# EAGLE design mcuPower (EAGLE 6.4)
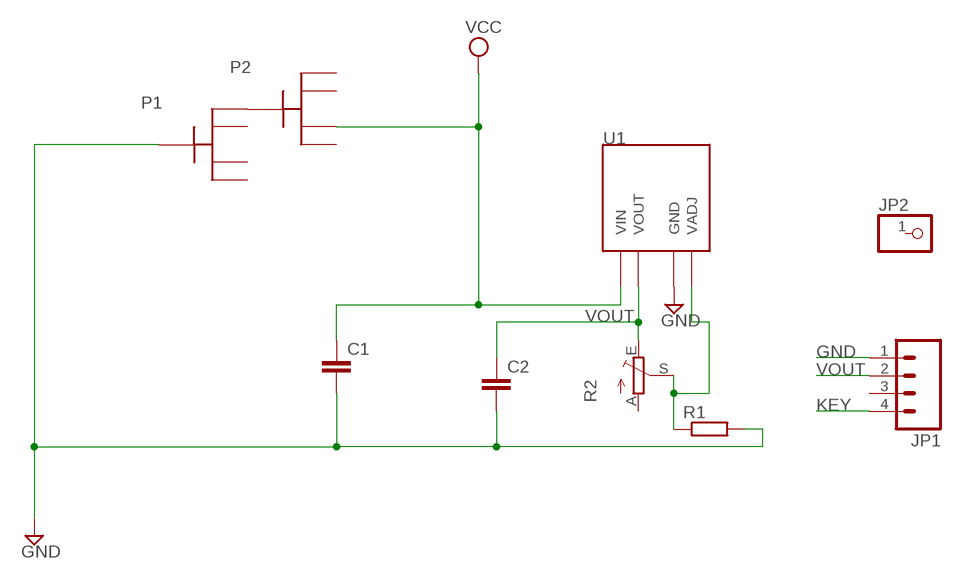
[diagram p0: schematic, sheet 1]

## Parts
C1  C-EUC0805  [C0805]
C2  C-EUC0805  [C0805]
JP1  M04PTH  [1X04]
JP2  PINHD-1X1  [1X01]
P1  CR2032  [CR2032/2025]
P2  CR2032  [CR2032/2025]
R1  R-EU_R0805  [R0805]
R2  TRIM_EU-B25P  [B25P]
U1  PQ070XF01SZH  [TO220-4]

## Nets
GND: C1.2 C2.2 JP1.1 P1.GND R1.2 U1.GND
KEY: JP1.4
N$1: P1.VCC_1 P2.GND
N$2: R1.1 R2.S U1.VADJ
VCC: C1.1 P2.VCC_3 U1.VIN
VOUT: C2.1 JP1.2 R2.E U1.VOUT
Unconnected: JP1.3 JP2.1 P1.VCC_2 P1.VCC_3 P1.VCC_4 P2.VCC_1 P2.VCC_2 P2.VCC_4 R2.A

## Library data of the parts
C1 C2 = resistor:C-EU: CAPACITOR, European symbol
JP1 = SparkFun-Connectors:M04: Header 4 Standard 4-pin 0.1" header. Use with straight break away headers (SKU : PRT-00116), right angle break away headers (PRT-00553), swiss pins (PRT-00743), machine pins (PRT-00117), and female headers (PRT-00115). Molex polarized connector foot print use with SKU : PRT-08231 with associated crimp pins and housings. 1MM SMD Version SKU: PRT-10208
JP2 = adafruit:PINHD-1X1: Pin header 1x1 for 0.1" spacing With round pins
P1 P2 = freddyLibr:CR2032: CR2032/2025 20mm 3V lithium coin cell Great for battery packup. Both SMT and THM holders. Note the THM package has the ground pads on both sides of the PCB so that the masks are the same - this reduces the cost
R1 = resistor:R-EU_: RESISTOR, European symbol
R2 = pot:TRIM_EU-: POTENTIOMETER
U1 = freddyLibr:PQ070XF01SZH: PQ070XF01SZH voltage regulator (TO220-4 package)

## Board
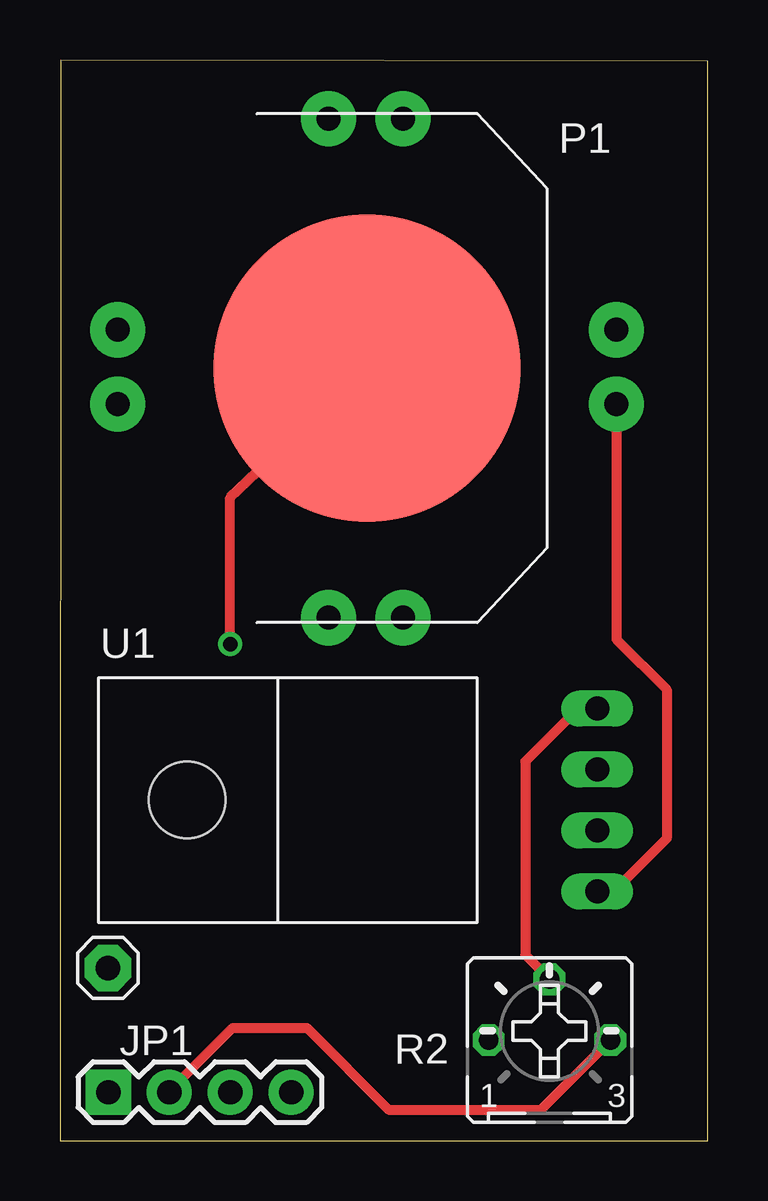
[diagram p1: board, top side]
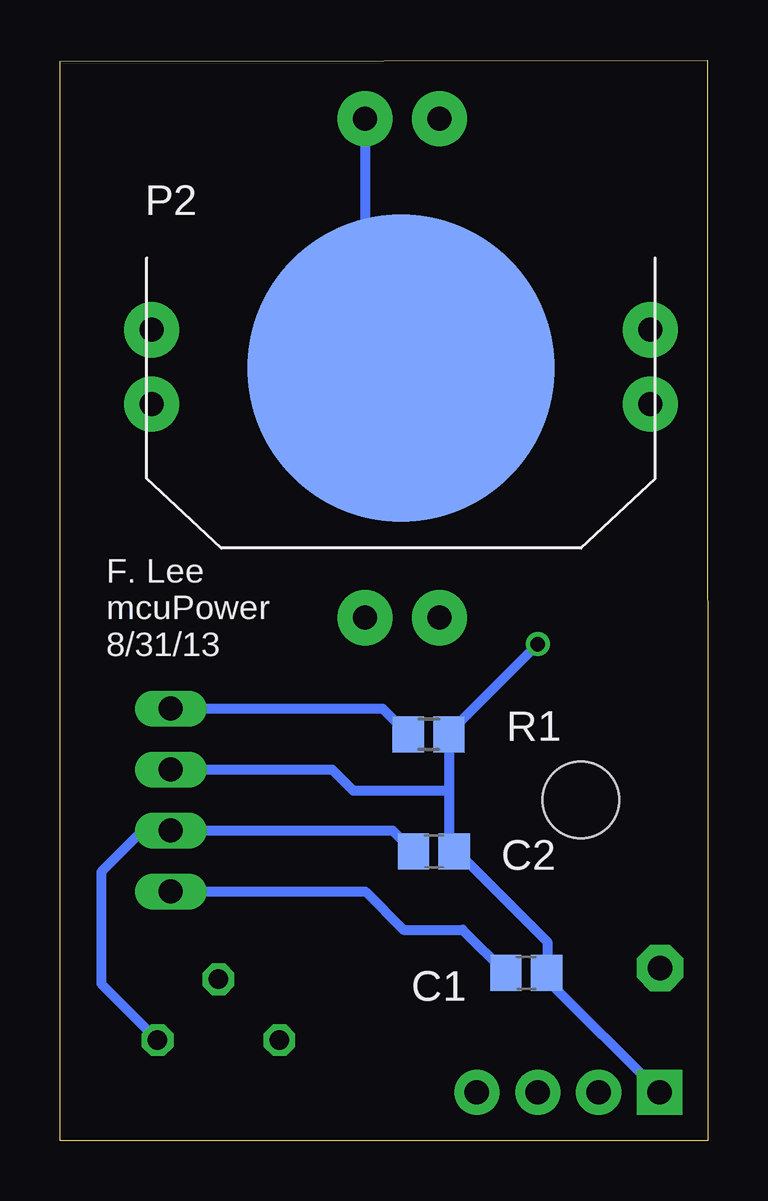
[diagram p2: board, bottom side, seen from below]

Size 27.02 x 45.05 mm. Coordinates in mm from the lower left corner, seen from the top.
Outline: 0,0 27.02,0 27.02,44.99 0.03,45.05 0,0
Copper layers (1*16): Top 0.035mm / dielectric 1.5mm / Bottom 0.035mm
Design rules "default *": minimum track width 10mil, minimum drill 20mil, track to track 8mil, track to pad 8mil, pad to pad 8mil, via to via 8mil, smd to smd 8mil, copper to edge 40mil, drill to drill 8mil, minimum pad ring 10mil, minimum via ring 8mil, stop-mask expansion 4mil, vias tented up to drill 0mil, thermal gap 10mil

### Footprints (pad centres in the part's own frame; a part is rotated, then mirrored left to right if it is on the bottom)
C0805 = smd 1.3 x 1.5: 1 -0.85,0; 2 0.85,0
1X04 = drill 1.016 pad 1.88 square: 1 0,0 | drill 1.016 pad 1.88: 2 2.54,0; 3 5.08,0; 4 7.62,0
1X01 = drill 1.016 pad 1.93 octagon: 1 0,0
CR2032/2025 = smd 12.8 x 12.8: GND 0,0 | drill 1 pad 2.3: VCC_1 -10.4,1.5; VCC_2 -10.4,-1.6; VCC_3 10.4,1.5; VCC_4 10.4,-1.6
R0805 = smd 1.3 x 1.5: 1 -0.85,0; 2 0.85,0
B25P = drill 0.813 octagon: A -2.54,0; E 2.54,0; S 0,2.54
TO220-4 = drill 1 long: GND 1.27,-13.3; VADJ 3.81,-13.3; VIN -3.81,-13.3; VOUT -1.27,-13.3 | hole 3.2: 0,3.8

### Placement (x,y rotation side)
C1  7.58,7 0 bottom
C2  11.43,12.06 0 bottom
JP1  2.02,2.02 0 top
JP2  2,7.2 0 top
P1  12.8,32.2 270 top
P2  12.8,32.2 180 bottom
R1  11.65,16.94 0 bottom
R2  20.41,4.19 0 top
U1  9.1,14.2 90 top

### Tracks (layer width: path | path; a pad name or v marks a point on that pad's centre or on a via)
GND  (via drill 0.6)
  Top 0.406: v7.1,20.7 7.1,26.8 P1.GND
  Bottom 0.406: JP1.1 6.73,6.73 C1.2 6.7,7.03 6.7,8.3 10.46,12.06 C2.2 10.8,12.28 10.8,14.6 | v7.1,20.7 10.8,17 R1.2 10.8,14.6 | U1.GND 15.67,15.47 14.8,14.6 10.8,14.6
N$1
  Bottom 0.406: P1.VCC_1 14.3,34 P2.GND
N$2
  Top 0.406: U1.VADJ 21.61,18.01 19.4,15.8 19.4,7.74 R2.S
  Bottom 0.406: U1.VADJ 13.57,18.01 R1.1
VCC
  Top 0.406: P2.VCC_3 23.2,20.9 25.3,18.8 25.3,12.6 23.1,10.4 U1.VIN
  Bottom 0.406: U1.VIN 14.29,10.39 12.7,8.8 10.23,8.8 C1.1
VOUT
  Top 0.406: JP1.2 4.56,2.06 7.2,4.7 10.3,4.7 13.7,1.3 20.06,1.3 R2.E
  Bottom 0.406: C2.1 13.15,12.93 U1.VOUT 23.57,12.93 25.3,11.2 25.3,6.54 R2.E

### Text on the board
bPlace: F. Lee / mcuPower / 8/31/13